# Altium project ELE_MODULE.PrjPcb
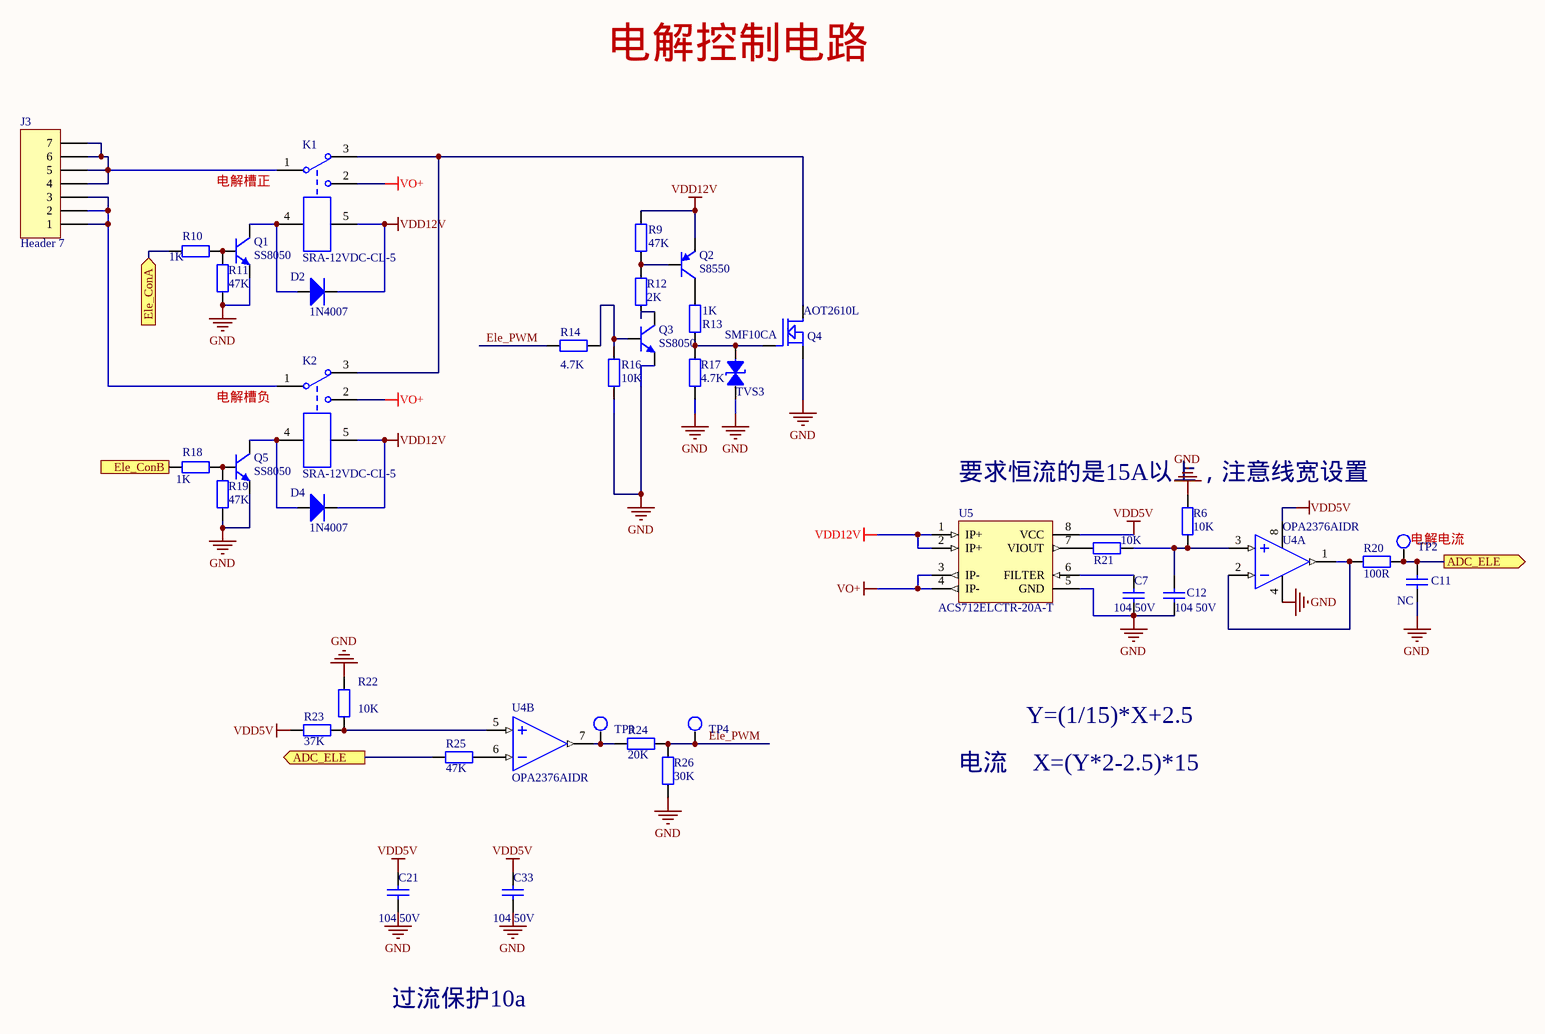
[diagram p0: 07_EL_CON.SchDoc]
4 sheets, 99 parts. Net scope: global (net labels, ports and power ports of the same name join across sheets).
Board file: PCB1.PcbDoc
Sheets:
  07_EL_CON.SchDoc
  com.SchDoc
  03_MCU.SchDoc
  02_Power.SchDoc

## Sheet 07_EL_CON.SchDoc
size A3

### Parts
C7  104 50V  [SMD-0603C]
C11  NC  [SMD-0603C]
C12  104 50V  [SMD-0603C]
C21  104 50V  [SMD-0603C]
C33  104 50V  [SMD-0603C]
D2  1N4007  [DO-214-AC]
D4  1N4007  [DO-214-AC]
J3  Header 7  [VH-AW-3.96*7P]
K1  SRA-12VDC-CL-5  [SRA- 12V]
K2  SRA-12VDC-CL-5  [SRA- 12V]
Q1  SS8050  [SOT-23]
Q2  S8550  [SOT-23]
Q3  SS8050  [SOT-23]
Q4  AOT2610L  [to220]
Q5  SS8050  [SOT-23]
R6  10K  [SMD-0603]
R9  47K  [SMD-0603]
R10  1K  [SMD-0603]
R11  47K  [SMD-0603]
R12  2K  [SMD-0603]
R13  1K  [SMD-0603]
R14  4.7K  [SMD-0603]
R16  10K  [SMD-0603]
R17  4.7K  [SMD-0603]
R18  1K  [SMD-0603]
R19  47K  [SMD-0603]
R20  100R  [SMD-0603]
R21  10K  [SMD-0603]
R22  10K  [SMD-0603]
R23  37K  [SMD-0603]
R24  20K  [SMD-0603]
R25  47K  [SMD-0603]
R26  30K  [SMD-0603]
TP2  TPS  [tpd]  (value not drawn)
TP3  TPS  [tpd]  (value not drawn)
TP4  TPS  [tpd]  (value not drawn)
TVS3  SMF10CA  [SOD-123]
U4  OPA2376AIDR  [SOIC-8]  (parts A,B of 2)
U5  ACS712ELCTR-20A-T  [SO-8]

### Ports
ADC_ELE (out), Ele_ConA (in), Ele_ConB (in)

### Nets
GND: C7.2 C11.1 C12.2 C21.1 C33.1 Q1.2(E) Q3.2(E) Q4.3(S) Q5.2(E) R6.1 R11.1 R16.1 R17.2 R19.1 R22.2 R26.2 TVS3.1(A) U4.4(V-) U5.5(GND)
VDD5V: C21.2 C33.2 R23.2 U4.8(V+) U5.8(VCC)
VDD12V: D2.2(K) D4.2(K) K1.5 K2.5 Q2.2(E) R9.2 U5.1(IP+) U5.2(IP+)
VO+: K1.2 K2.2 U5.3(IP-) U5.4(IP-)
Ele_PWM: R14.2 R24.1 R26.1 TP4.1
NetC7_1: C7.1 U5.6(FILTER)
NetC11_2: C11.2 R20.1 R25.2 TP2.1 ; port ADC_ELE
NetC12_1: C12.1 R6.2 R21.1 U4.3(IN1+)
NetD2_1: D2.1(A) K1.4 Q1.3(C)
NetD4_1: D4.1(A) K2.4 Q5.3(C)
NetJ3_1: J3.1 J3.2 J3.3 K2.1
NetJ3_4: J3.4 J3.5 J3.6 J3.7 K1.1
NetK1_3: K1.3 K2.3 Q4.2(D)
NetQ1_1: Q1.1(B) R10.2 R11.2
NetQ2_1: Q2.1(B) R9.1 R12.1
NetQ2_3: Q2.3(C) R13.2
NetQ3_1: Q3.1(B) R14.1 R16.2
NetQ3_3: Q3.3(C) R12.2
NetQ4_1: Q4.1(G) R13.1 R17.1 TVS3.2(B)
NetQ5_1: Q5.1(B) R18.2 R19.2
NetR10_1: R10.1 ; port Ele_ConA
NetR18_1: R18.1 ; port Ele_ConB
NetR20_2: R20.2 U4.1(OUT1) U4.2(IN1-)
NetR21_2: R21.2 U5.7(VIOUT)
NetR22_1: R22.1 R23.1 U4.5(IN2+)
NetR24_2: R24.2 TP3.1 U4.7(OUT2)
NetR25_1: R25.1 U4.6(IN2-)

### Notes on the sheet
- 电解控制电路
- 电解槽正
- 电解槽负
- (near R6) 要求恒流的是15A以上，注意线宽设置
- (near TP2) 电解电流
- Y=(1/15)*X+2.5
- 电流
- X=(Y*2-2.5)*15
- 过流保护10a

### Library data of the parts
C7 = C: 贴片电容 10%
C11 C12 = CAP4: 贴片电容 10%
C21 C33 = CAP4: 贴片电容 20%
D2 D4 = DIODE2: 贴片二极管
J3 = Header 7: Header, 7-Pin; LatestRevisionDate: 17-Jul-2002; LatestRevisionNote: Re-released for DXP Platform.; Publisher: Altium Limited
K1 K2 = JDQ1: 5V 继电器
Q1 Q3 Q5 = NPN-1: 三极管
Q2 = PNP
Q4 = SI7860
R6 R21 = RES0: 贴片电阻 1%
R9 R12-R14 R16 R17 R22-R26 = RES-SOP: 贴片电阻 5%
R10 R11 R18 R19 = RES2: 贴片电阻 5%
R20 = RES0: 贴片电阻 5%
TVS3 = TVS-1: TVS 10V
U4 = LM358: 运算放大器
U5 = ACS712: HALL 20A 电流传感器

## Sheet com.SchDoc
size A4
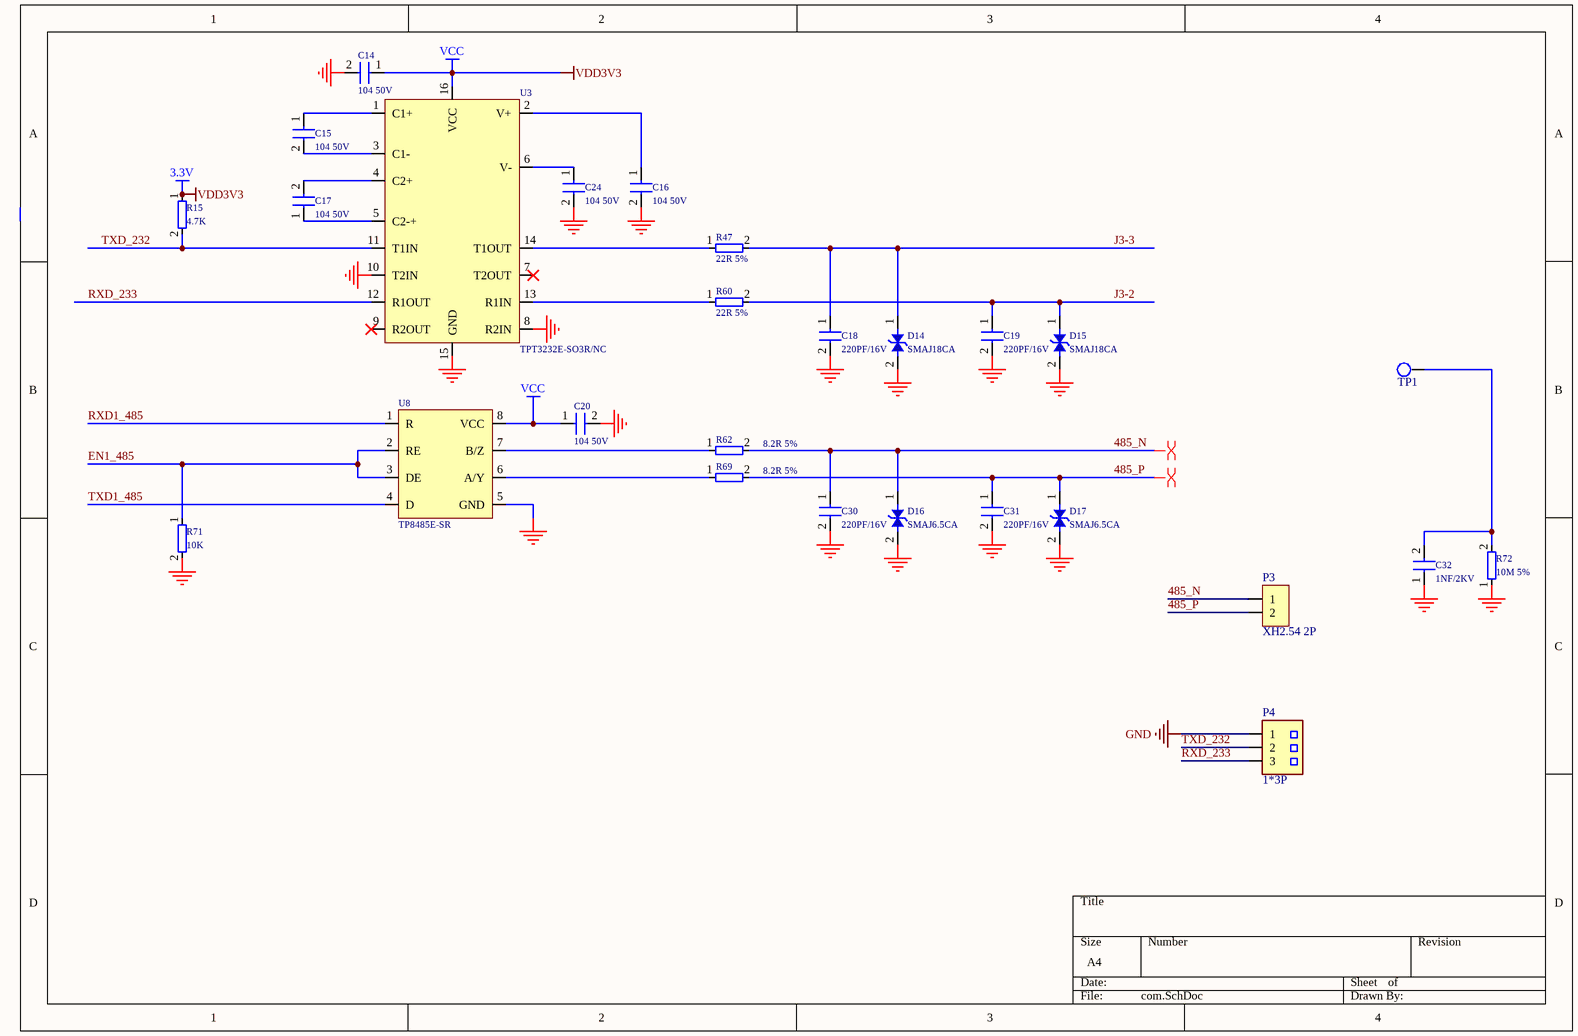
[diagram p1: com.SchDoc]

### Parts
C14  104 50V  [0603C]
C15  104 50V  [0603C]
C16  104 50V  [0603C]
C17  104 50V  [0603C]
C18  220PF/16V  [0603C]
C19  220PF/16V  [0603C]
C20  104 50V  [0603C]
C24  104 50V  [0603C]
C30  220PF/16V  [0603C]
C31  220PF/16V  [0603C]
C32  1NF/2KV  [1206C]
D14  SMAJ18CA  [SMA]
D15  SMAJ18CA  [SMA]
D16  SMAJ6.5CA  [SMA]
D17  SMAJ6.5CA  [SMA]
P3  XH2.54 2P  [SIP-2A]
P4  1*3P  [3X2.54MMZ2]
R15  4.7K  [0603R]
R47  22R 5%  [0603R]
R60  22R 5%  [0603R]
R62  8.2R 5%  [0603R]
R69  8.2R 5%  [0603R]
R71  10K  [0603R]
R72  10M 5%  [1206r]
TP1  TPS  [tpd]  (value not drawn)
U3  TPT3232E-SO3R/NC  [SO-16Z]
U8  TP8485E-SR  [SO-8]

### Nets
3.3V: C14.1 C20.1 R15.1 U3.16(VCC) U8.8(VCC)  [also labelled VCC, VDD3V3]
GND: C14.2 C16.2 C18.2 C19.2 C20.2 C24.2 C30.2 C31.2 C32.1 D14.2 D15.2 D16.2 D17.2 P4.1 R71.2 R72.1 U3.8(R2IN) U3.10(T2IN) U3.15(GND) U8.5(GND)
485_N: C30.1 D16.1 P3.1 R62.2
485_P: C31.1 D17.1 P3.2 R69.2
EN1_485: R71.1 U8.2(RE) U8.3(DE)
J3-2: C19.1 D15.1 R60.2
J3-3: C18.1 D14.1 R47.2
RXD1_485: U8.1(R)
RXD_233: P4.3 U3.12(R1OUT)
TXD1_485: U8.4(D)
TXD_232: P4.2 R15.2 U3.11(T1IN)
NetC15_1: C15.1 U3.1(C1+)
NetC15_2: C15.2 U3.3(C1-)
NetC16_1: C16.1 U3.2(V+)
NetC17_1: C17.1 U3.5(C2-+)
NetC17_2: C17.2 U3.4(C2+)
NetC24_1: C24.1 U3.6(V-)
NetC32_2: C32.2 R72.2 TP1.1
NetR47_1: R47.1 U3.14(T1OUT)
NetR60_1: R60.1 U3.13(R1IN)
NetR62_1: R62.1 U8.7(B/Z)
NetR69_1: R69.1 U8.6(A/Y)

Not connected (* = marked no-connect by the designer): U3 7(T2OUT)* 9(R2OUT)*

### Layout directives
differential pair: 485_N, 485_P

### Library data of the parts
C14-C20 C24 C30-C32 = CAP
D14-D17 = D_ESD
P3 = SIP-2: XH2.54 2P 直插
P4 = HDR1*3
R15 R47 R60 R62 R69 R71 R72 = RES
U3 = TPT3232E-SO3R

## Sheet 03_MCU.SchDoc
size A4
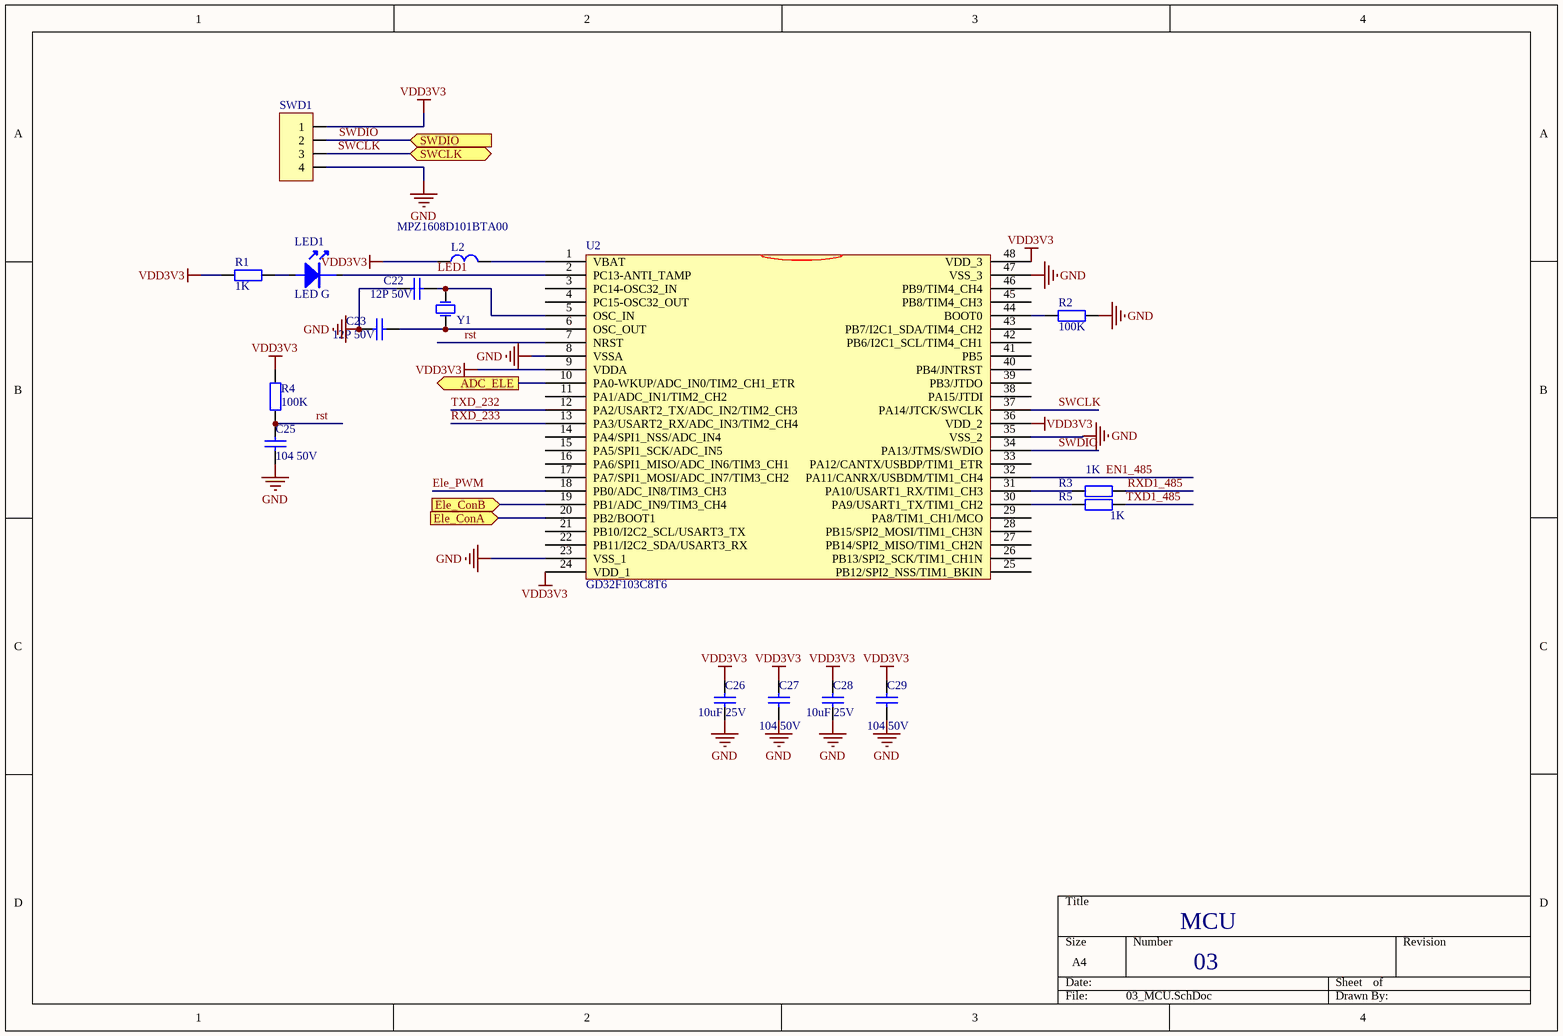
[diagram p2: 03_MCU.SchDoc]

### Parts
C22  12P 50V  [SMD-0603C]
C23  12P 50V  [SMD-0603C]
C25  104 50V  [SMD-0603C]
C26  10uF 25V  [SMD-0805C]
C27  104 50V  [SMD-0603C]
C28  10uF 25V  [SMD-0805C]
C29  104 50V  [SMD-0603C]
L2  MPZ1608D101BTA00  [SMD-0603]
LED1  LED G  [SMD-0603D]
R1  1K  [SMD-0603]
R2  100K  [SMD-0603]
R3  1K  [SMD-0603]
R4  100K  [SMD-0603]
R5  1K  [SMD-0603]
SWD1  SIP-4 (NC)  [SIP-4]  (value not drawn)
U2  GD32F103C8T6  [LQFP48]
Y1  8MHz  [XTAL-3225-2]  (value not drawn)

### Ports
ADC_ELE (out), Ele_ConA (in), Ele_ConB (in), SWCLK (bidir), SWDIO (in)

### Nets
GND: C22.2 C23.2 C25.1 C26.1 C27.1 C28.1 C29.1 R2.2 SWD1.4 U2.8(VSSA) U2.23(VSS_1) U2.35(VSS_2) U2.47(VSS_3)
VDD3V3: C26.2 C27.2 C28.2 C29.2 L2.2 R1.2 R4.1 SWD1.1 U2.9(VDDA) U2.24(VDD_1) U2.36(VDD_2) U2.48(VDD_3)  [project net 3.3V]
Ele_PWM: U2.18(PB0/ADC_IN8/TIM3_CH3)
EN1_485: U2.32(PA11/CANRX/USBDM/TIM1_CH4)
LED1: LED1.2(K) U2.2(PC13-ANTI_TAMP)
rst: C25.2 R4.2 U2.7(NRST)
RXD1_485: R3.2
RXD_233: U2.13(PA3/USART2_RX/ADC_IN3/TIM2_CH4)
SWCLK: SWD1.3 U2.37(PA14/JTCK/SWCLK) ; port SWCLK
SWDIO: SWD1.2 U2.34(PA13/JTMS/SWDIO) ; port SWDIO
TXD1_485: R5.2
TXD_232: U2.12(PA2/USART2_TX/ADC_IN2/TIM2_CH3)
NetC11_2: U2.10(PA0-WKUP/ADC_IN0/TIM2_CH1_ETR) ; port ADC_ELE
NetC22_1: C22.1 U2.5(OSC_IN) Y1.1(OSC1)
NetC23_1: C23.1 U2.6(OSC_OUT) Y1.2(OSC2)
NetL2_1: L2.1 U2.1(VBAT)
NetLED1_1: LED1.1(A) R1.1
NetR2_1: R2.1 U2.44(BOOT0)
NetR3_1: R3.1 U2.31(PA10/USART1_RX/TIM1_CH3)
NetR5_1: R5.1 U2.30(PA9/USART1_TX/TIM1_CH2)
NetR10_1: U2.20(PB2/BOOT1) ; port Ele_ConA
NetR18_1: U2.19(PB1/ADC_IN9/TIM3_CH4) ; port Ele_ConB

Not connected (* = marked no-connect by the designer): U2 3(PC14-OSC32_IN) 4(PC15-OSC32_OUT) 11(PA1/ADC_IN1/TIM2_CH2) 14(PA4/SPI1_NSS/ADC_IN4) 15(PA5/SPI1_SCK/ADC_IN5) 16(PA6/SPI1_MISO/ADC_IN6/TIM3_CH1) 17(PA7/SPI1_MOSI/ADC_IN7/TIM3_CH2) 21(PB10/I2C2_SCL/USART3_TX) 22(PB11/I2C2_SDA/USART3_RX) 25(PB12/SPI2_NSS/TIM1_BKIN) 26(PB13/SPI2_SCK/TIM1_CH1N) 27(PB14/SPI2_MISO/TIM1_CH2N) 28(PB15/SPI2_MOSI/TIM1_CH3N) 29(PA8/TIM1_CH1/MCO) 33(PA12/CANTX/USBDP/TIM1_ETR) 38(PA15/JTDI) 39(PB3/JTDO) 40(PB4/JNTRST) 41(PB5) 42(PB6/I2C1_SCL/TIM4_CH1) 43(PB7/I2C1_SDA/TIM4_CH2) 45(PB8/TIM4_CH3) 46(PB9/TIM4_CH4)

### Notes on the sheet
- MCU
- 03

### Library data of the parts
C22 C23 = CAP4: 贴片电容 5%
C25-C29 = CAP4: 贴片电容 20%
L2 = CIZHU1: 磁珠电感 100R 100MHz
LED1 = LED: 绿色普亮
R1 = RES0: 贴片电阻 5%
R2-R5 = RES2: 贴片电阻 5%
SWD1 = SIP-4: ISP 下载
U2 = STM32F103C6
Y1 = XTAL: 3225 贴片晶振

## Sheet 02_Power.SchDoc
size A4
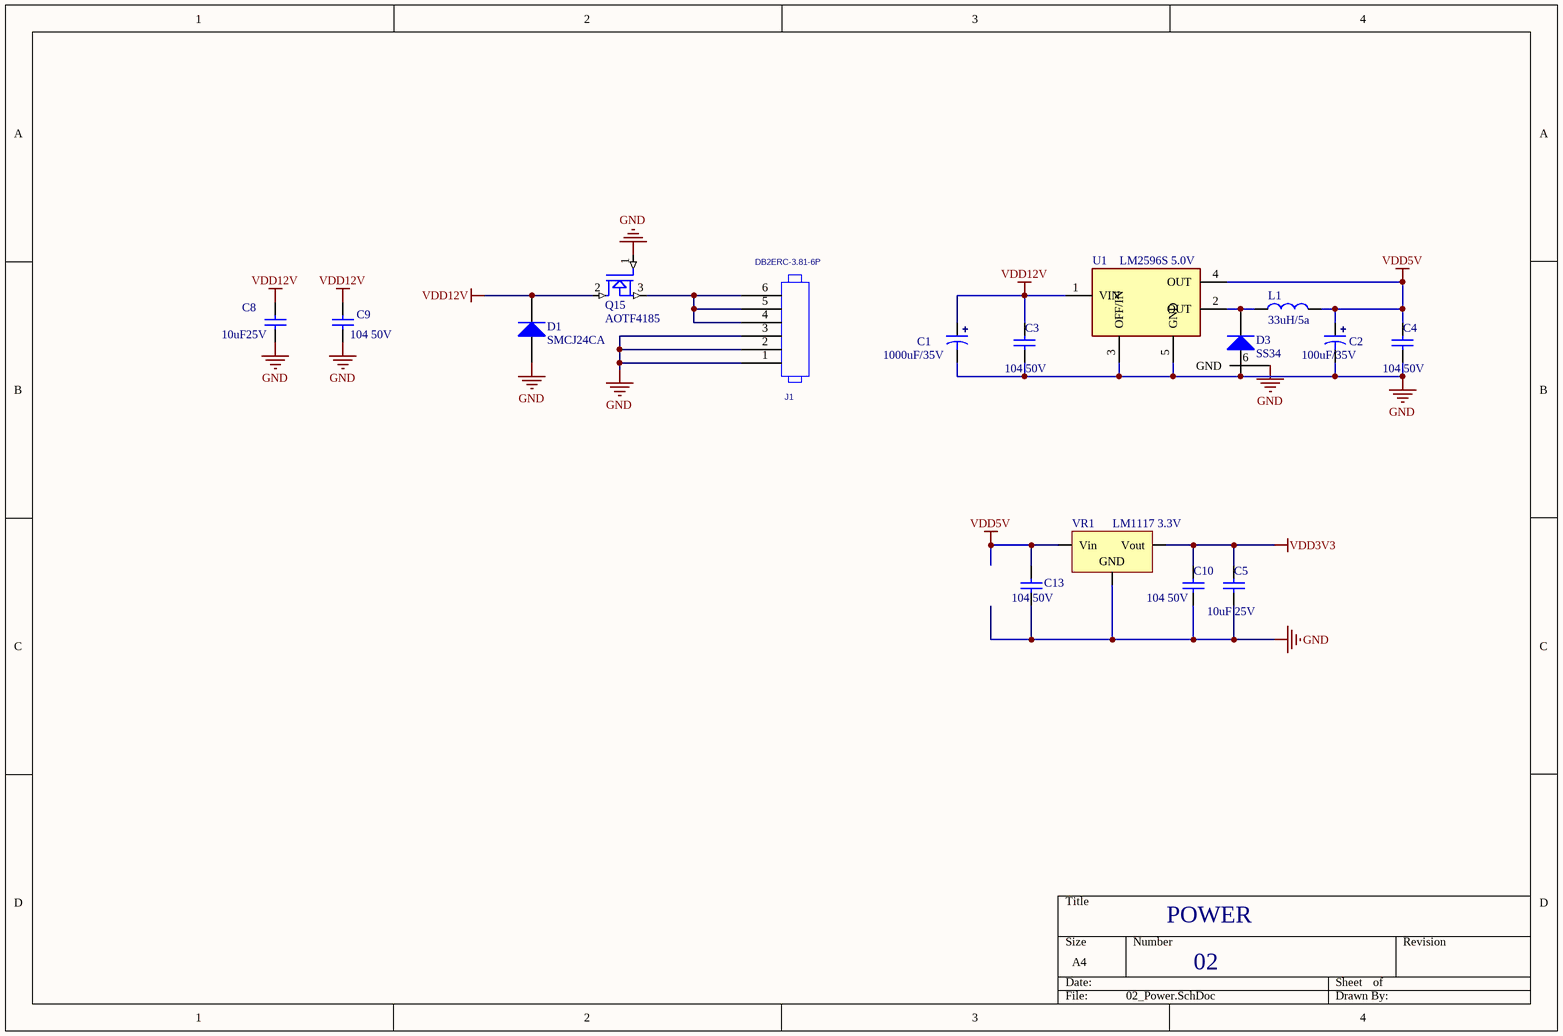
[diagram p3: 02_Power.SchDoc]

### Parts
C1  1000uF/35V  [10*16]
C2  100uF/35V  [6*8]
C3  104 50V  [SMD-0603C]
C4  104 50V  [SMD-0603C]
C5  10uF 25V  [SMD-0805C]
C8  10uF25V  [SMD-0805C]
C9  104 50V  [SMD-0603C]
C10  104 50V  [SMD-0603C]
C13  104 50V  [SMD-0603C]
D1  SMCJ24CA  [SMC]
D3  SS34  [SMA]
J1  value DB2ERC-3.81-6P  [VH-AW-3.96*6P]  (hidden comment: HEADER_6)
L1  33uH/5a  [CDRH-127]
Q15  AOTF4185  [to220]
U1  LM2596S 5.0V  [TO-263-5]
VR1  LM1117 3.3V  [SOT223]

### Nets
GND: C1.2 C2.2 C3.1 C4.1 C5.1 C8.1 C9.1 C10.1 C13.1 D1.1(A) D3.1(A) J1.1 J1.2 J1.3 Q15.1(G) U1.3(OFF/IN) U1.5(GND) U1.6(GND) VR1.1(GND)
VDD3V3: C5.2 C10.2 VR1.2(Vout)  [project net 3.3V]
VDD5V: C2.1 C4.2 C13.2 L1.2 U1.4(OUT) VR1.3(Vin)
VDD12V: C1.1 C3.2 C8.2 C9.2 D1.2(K) Q15.2(D) U1.1(VIN)
NetD3_2: D3.2(K) L1.1 U1.2(OUT)
NetJ1_4: J1.4 J1.5 J1.6 Q15.3(S)

### Notes on the sheet
- POWER
- 02

### Library data of the parts
C1 C2 = CAP2: 电解电容
C3 C4 C8-C10 C13 = CAP4: 贴片电容 10%
C5 = CAP4: 贴片电容 20%
D1 D3 = DIODE
J1 = HEADER_6: PCB DECAL: DB2ERC-3P81-6P; Source_Path: C:\MYPROGRAM\CADENCE\SPB_16.6\TOOLS\CAPTURE\LIBRARY\CONNECTOR.OLB
L1 = IND
Q15 = MOSFET N
U1 = LM2596
VR1 = LM1117: 三端稳压器

## Nets that join several sheets
3.3V: com (5 pins), 03_MCU (12 pins), 02_Power (C5.2 C10.2 VR1.2)
GND: 07_EL_CON (19 pins), com (20 pins), 03_MCU (13 pins), 02_Power (19 pins)
VDD5V: 07_EL_CON (5 pins), 02_Power (6 pins)
VDD12V: 07_EL_CON (8 pins), 02_Power (7 pins)
Ele_PWM: 07_EL_CON (R14.2 R24.1 R26.1 TP4.1), 03_MCU (U2.18)
EN1_485: com (R71.1 U8.2 U8.3), 03_MCU (U2.32)
NetC11_2: 07_EL_CON (C11.2 R20.1 R25.2 TP2.1), 03_MCU (U2.10)
NetR10_1: 07_EL_CON (R10.1), 03_MCU (U2.20)
NetR18_1: 07_EL_CON (R18.1), 03_MCU (U2.19)
RXD1_485: com (U8.1), 03_MCU (R3.2)
RXD_233: com (P4.3 U3.12), 03_MCU (U2.13)
TXD1_485: com (U8.4), 03_MCU (R5.2)
TXD_232: com (P4.2 R15.2 U3.11), 03_MCU (U2.12)